# EAGLE schematic schematic (EAGLE 8.6.0)
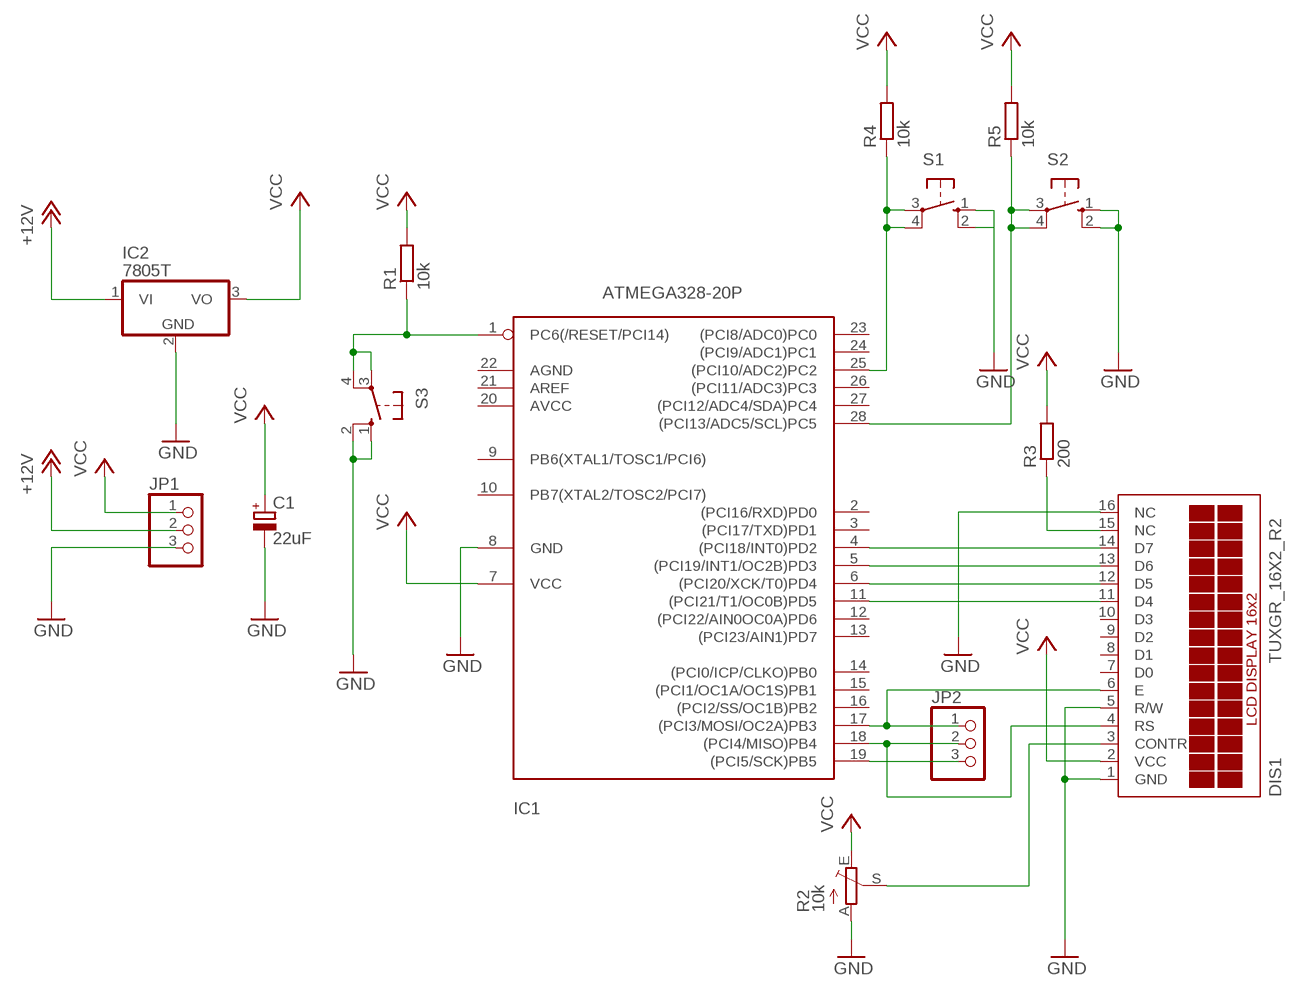
[diagram p0: schematic, sheet 1]

## Parts
C1  22uF  CPOL-EUE2.5-5  [E2,5-5]
DIS1  TUXGR_16X2_R2  [TUXGR_16X2_R2]
IC1  ATMEGA328-20P  [DIL28-3]
IC2  7805T  [TO220H]
JP1  PINHD-1X3  [1X03]
JP2  PINHD-1X3  [1X03]
R1  10k  R-EU_0207/7  [0207/7]
R2  10k  TRIM_EU-CIP20C-6MM  [CIP20C-6MM]
R3  200  R-EU_0207/7  [0207/7]
R4  10k  R-EU_0207/7  [0207/7]
R5  10k  R-EU_0207/7  [0207/7]
S1  10-XX  [B3F-10XX]
S2  10-XX  [B3F-10XX]
S3  10-XX  [B3F-10XX]

## Nets
+12V: IC2.1(VI) JP1.2
GND: C1.- DIS1.1(GND) DIS1.5(R/W) DIS1.16(NC) IC1.8(GND) IC2.2(GND) JP1.3 R2.A S1.1(S) S1.2(S1) S2.1(S) S2.2(S1) S3.1(S) S3.2(S1)
N$2: IC1.1(PC6(/RESET/PCI14)) R1.1 S3.3(P) S3.4(P1)
N$5: IC1.19((PCI5/SCK)PB5) JP2.3
N$6: DIS1.4(RS) IC1.18((PCI4/MISO)PB4) JP2.2
N$7: DIS1.6(E) IC1.17((PCI3/MOSI/OC2A)PB3) JP2.1
N$8: DIS1.14(D7) IC1.4((PCI18/INT0)PD2)
N$9: DIS1.13(D6) IC1.5((PCI19/INT1/OC2B)PD3)
N$10: DIS1.12(D5) IC1.6((PCI20/XCK/T0)PD4)
N$11: DIS1.11(D4) IC1.11((PCI21/T1/OC0B)PD5)
N$13: DIS1.3(CONTR) R2.S
N$17: DIS1.15(NC) R3.1
N$18: IC1.25((PCI10/ADC2)PC2) R4.1 S1.3(P) S1.4(P1)
N$21: IC1.28((PCI13/ADC5/SCL)PC5) R5.1 S2.3(P) S2.4(P1)
VCC: C1.+ DIS1.2(VCC) IC1.7(VCC) IC2.3(VO) JP1.1 R1.2 R2.E R3.2 R4.2 R5.2
Unconnected: DIS1.7(D0) DIS1.8(D1) DIS1.9(D2) DIS1.10(D3) IC1.2((PCI16/RXD)PD0) IC1.3((PCI17/TXD)PD1) IC1.9(PB6(XTAL1/TOSC1/PCI6)) IC1.10(PB7(XTAL2/TOSC2/PCI7)) IC1.12((PCI22/AIN0OC0A)PD6) IC1.13((PCI23/AIN1)PD7) IC1.14((PCI0/ICP/CLKO)PB0) IC1.15((PCI1/OC1A/OC1S)PB1) IC1.16((PCI2/SS/OC1B)PB2) IC1.20(AVCC) IC1.21(AREF) IC1.22(AGND) IC1.23((PCI8/ADC0)PC0) IC1.24((PCI9/ADC1)PC1) IC1.26((PCI11/ADC3)PC3) IC1.27((PCI12/ADC4/SDA)PC4)

## Library data of the parts
C1 = rcl:CPOL-EU: POLARIZED CAPACITOR, European symbol; SPICEPREFIX: C
DIS1 = display-lcd:TUXGR_16X2_R2: Tuxgraphics LCD display 16x2 characters reflective, without background light Source: tuxgr_12x2_r2.pdf; OC_FARNELL: unknown; OC_NEWARK: unknown
IC1 = atmega328:ATMEGA328*P: MICROCONTROLLER 32 kBytes FLASH 2 kBytes SRAM 1 kBytes EEPROM USART 8-channel 10 bit ADC
IC2 = linear:78*: Positive VOLTAGE REGULATOR Source: http://cache.national.com/ds/LM/LM78L05.pdf http://www.fairchildsemi.com/ds/LM/LM7805.pdf
JP1 JP2 = pinhead:PINHD-1X3: PIN HEADER
R1 R3-R5 = rcl:R-EU_: RESISTOR, European symbol; SPICEPREFIX: R
R2 = pot:TRIM_EU-: POTENTIOMETER
S1-S3 = switch-omron:10-XX: OMRON SWITCH; MPN: B3F-1000; OC_FARNELL: 176432; OC_NEWARK: 36M3542